# EAGLE schematic co-processor (EAGLE 7.5.0)
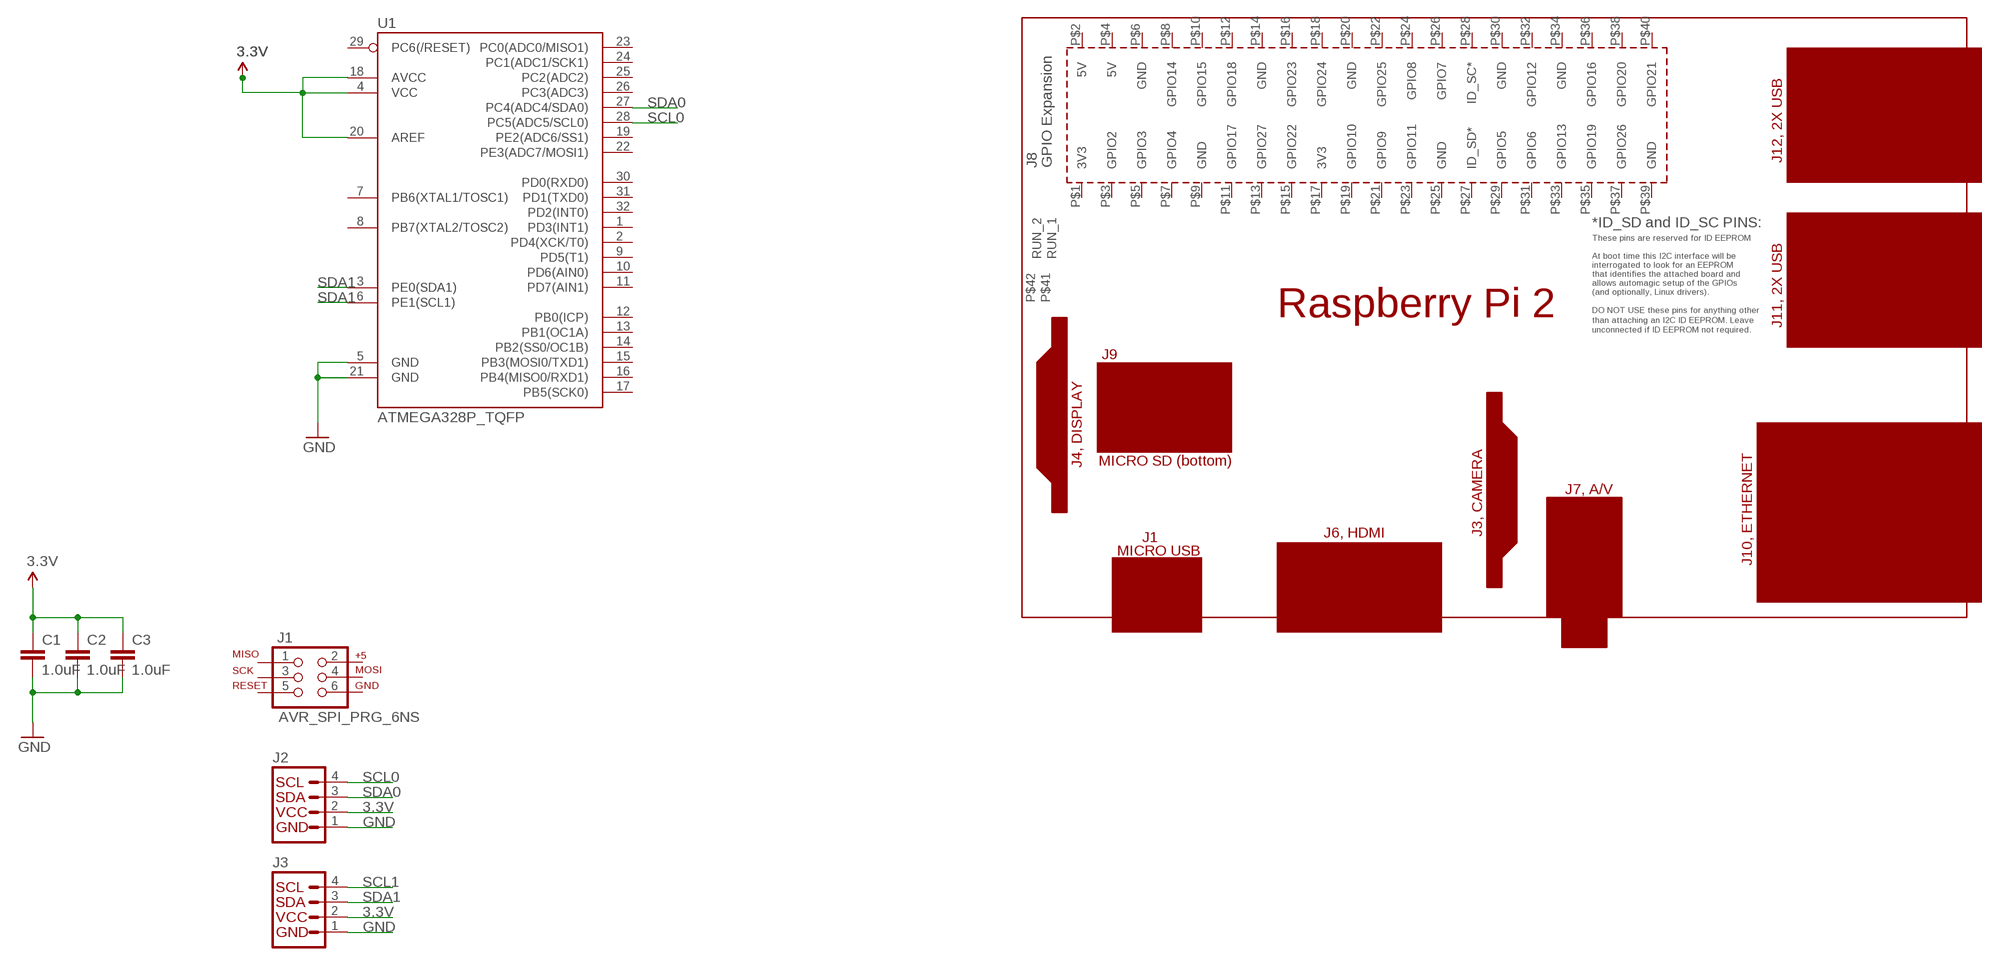
[diagram p0: schematic, sheet 1]

## Parts
C1  1.0uF  1.0UF-16V-10%(0603)  [0603-CAP]
C2  1.0uF  1.0UF-16V-10%(0603)  [0603-CAP]
C3  1.0uF  1.0UF-16V-10%(0603)  [0603-CAP]
J1  AVR_SPI_PRG_6NS  [2X3-NS]
J2  I2C_STANDARD  [1X04]
J3  I2C_STANDARD  [1X04]
PCB1  RPI2  [RPI2]
U1  ATMEGA328P_TQFP  ATMEGA328PB_TQFP  [TQFP32-08]

## Nets
3.3V: C1.1 C2.1 C3.1 J2.2 J3.2 U1.4(VCC) U1.18(AVCC) U1.20(AREF)
GND: C1.2 C2.2 C3.2 J2.1 J3.1 U1.5(GND) U1.21(GND)
SCL0: J2.4 U1.28(PC5(ADC5/SCL0))
SCL1: J3.4
SDA0: J2.3 U1.27(PC4(ADC4/SDA0))
SDA1: J3.3 U1.3(PE0(SDA1)) U1.6(PE1(SCL1))
Unconnected: J1.1 J1.2 J1.3 J1.4 J1.5 J1.6 PCB1.P$1(3V3) PCB1.P$2(5V) PCB1.P$3(GPIO2) PCB1.P$4(5V) PCB1.P$5(GPIO3) PCB1.P$6(GND) PCB1.P$7(GPIO4) PCB1.P$8(GPIO14) PCB1.P$9(GND) PCB1.P$10(GPIO15) PCB1.P$11(GPIO17) PCB1.P$12(GPIO18) PCB1.P$13(GPIO27) PCB1.P$14(GND) PCB1.P$15(GPIO22) PCB1.P$16(GPIO23) PCB1.P$17(3V3) PCB1.P$18(GPIO24) PCB1.P$19(GPIO10) PCB1.P$20(GND) PCB1.P$21(GPIO9) PCB1.P$22(GPIO25) PCB1.P$23(GPIO11) PCB1.P$24(GPIO8) PCB1.P$25(GND) PCB1.P$26(GPIO7) PCB1.P$27(ID_SD*) PCB1.P$28(ID_SC*) PCB1.P$29(GPIO5) PCB1.P$30(GND) PCB1.P$31(GPIO6) PCB1.P$32(GPIO12) PCB1.P$33(GPIO13) PCB1.P$34(GND) PCB1.P$35(GPIO19) PCB1.P$36(GPIO16) PCB1.P$37(GPIO26) PCB1.P$38(GPIO20) PCB1.P$39(GND) PCB1.P$40(GPIO21) PCB1.P$41(RUN_1) PCB1.P$42(RUN_2) U1.1(PD3(INT1)) U1.2(PD4(XCK/T0)) U1.7(PB6(XTAL1/TOSC1)) U1.8(PB7(XTAL2/TOSC2)) U1.9(PD5(T1)) U1.10(PD6(AIN0)) U1.11(PD7(AIN1)) U1.12(PB0(ICP)) U1.13(PB1(OC1A)) U1.14(PB2(SS0/OC1B)) U1.15(PB3(MOSI0/TXD1)) U1.16(PB4(MISO0/RXD1)) U1.17(PB5(SCK0)) U1.19(PE2(ADC6/SS1)) U1.22(PE3(ADC7/MOSI1)) U1.23(PC0(ADC0/MISO1)) U1.24(PC1(ADC1/SCK1)) U1.25(PC2(ADC2)) U1.26(PC3(ADC3)) U1.29(PC6(/RESET)) U1.30(PD0(RXD0)) U1.31(PD1(TXD0)) U1.32(PD2(INT0))

## Library data of the parts
C1-C3 = SparkFun-Capacitors:1.0UF-16V-10%(0603): CAP-00868; PROD_ID: CAP-00868
J1 = SparkFun-Connectors:AVR_SPI_PRG_6: AVR ISP 6 Pin This is the reduced ISP connector for AVR programming. Common on Arduino. This footprint will take up less PCB space and can be used with a 10-pin to 6-pin adapter such as SKU: BOB-08508 **Special note about "TEST_POINT" package. The stop mask is on the top side, so if you want your programming test points to be on the bottom of your board, make sure to place this package on the bottom side of the board. This also ensure that the orientation to program from the bottom side will be correct.
J2 J3 = SparkFun-Connectors:I2C_STANDARD: SparkFun has standardized on a pinout for all I2C based sensor breakouts. This pinout allows I2C boards to be plugged directly into the headers on Arduino Uno compatible boards, and to be daisy chained easily.
PCB1 = e14_Rpi2_RevA:RPI2: Device for Raspberry Pi 2 board created by www.element14.com More information and support community is available at http://www.element14.com/community/community/raspberry-pi/raspberrypi2
U1 = atmega328pb_tqfn:ATMEGA328PB_TQFP; PROD_ID: IC-09069